# Altium schematic sheet Power.SchDoc
size A4; SheetNumber: 2; SheetTotal: 5
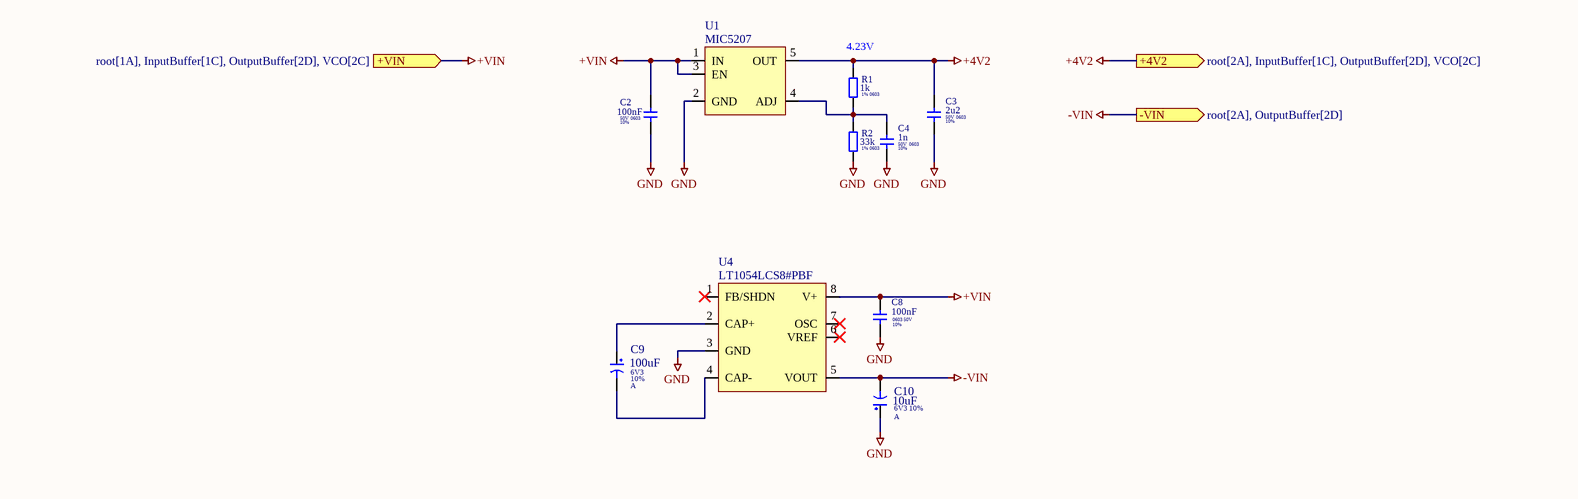
[diagram p0: Power.SchDoc]

## Parts
C2  value 100nF  Voltage: 50V  Tolerant: 10%  Package: 0603  [CAPC1608X06M]  (hidden comment: 100nF/50V)
C3  value 2u2  Voltage: 50V  Tolerant: 10%  Package: 0603  [CAPC1608X06M]  (hidden comment: 2u2/50V)
C4  value 1n  Voltage: 50V  Tolerant: 10%  Package: 0603  [CAPC1608X06M]  (hidden comment: 1n/50V)
C8  value 100nF  Voltage: 50V  Tolerant: 10%  Package: 0603  [CAPC1608X06M]  (hidden comment: 100nF/50V)
C9  value 100uF  Voltage: 6V3  Package: A  Tolerant: 10%  [CAPMP3217X16L]  (hidden comment: 100uF/6V3)
C10  value 10uF  Voltage: 6V3  Package: A  Tolerant: 10%  [CAPMP3217X16L]  (hidden comment: 10uF/6V3)
R1  value 1k  Package: 0603  Tolerance: 1%  [RESC1608X06L]  (hidden comment: 1k 1%)
R2  value 33k  Package: 0603  Tolerance: 1%  [RESC1608X06L]  (hidden comment: 33k 1%)
U1  MIC5207  [SOT95P245X110-5M]
U4  LT1054LCS8#PBF  [SOIC-8]

## Ports
+4V2 (out, see root[2A], InputBuffer[1C], OutputBuffer[2D], VCO[2C]), +VIN (in, see root[1A], InputBuffer[1C], OutputBuffer[2D], VCO[2C]), -VIN (out, see root[2A], OutputBuffer[2D])

## Nets
+4V2: C3.2 R1.2 U1.5(OUT) ; port +4V2
+VIN: C2.2 C8.2 U1.1(IN) U1.3(EN) U4.8(V+) ; port +VIN
-VIN: C10.2 U4.5(VOUT) ; port -VIN
GND: C2.1 C3.1 C4.1 C8.1 C10.1 R2.1 U1.2(GND) U4.3(GND)
NetC4_2: C4.2 R1.1 R2.2 U1.4(ADJ)
NetC9_1: C9.1 U4.2(CAP+)
NetC9_2: C9.2 U4.4(CAP-)

Not connected (* = marked no-connect by the designer): U4 1(FB/SHDN)* 6(VREF)* 7(OSC)*

## Notes on the sheet
- (near R1) 4.23V

## Library data of the parts
C2-C4 C8 = C
C9 C10 = C_TANTAL: WORKPLAN_Code: EP00; manufacture: *; helpurl: *
R1 R2 = R
U1 = MIC5207YM5-TR: 180 mA Low-Noise LDO Regulator; Manufacture: Microchip; helpurl: https://ww1.microchip.com/downloads/aemDocuments/documents/APID/ProductDocuments/DataSheets/MIC5207-180mA-Low-Noise-LDO-Regulator-DS20005719C.pdf; value: MIC5207
U4 = LT1054: Switched-Capacitor Voltage / Converter with Regulator; Manufacturer: AnalogDevices; DataSheet: https://www.mouser.pl/datasheet/2/609/LT1054_1054L-1775938.pdf; Mouser: https://www.mouser.pl/ProductDetail/Analog-Devices/LT1054LCS8PBF?qs=ytflclh7QUUfK4FckUJTaA%3D%3D; value: LT1054LCS8#PBF